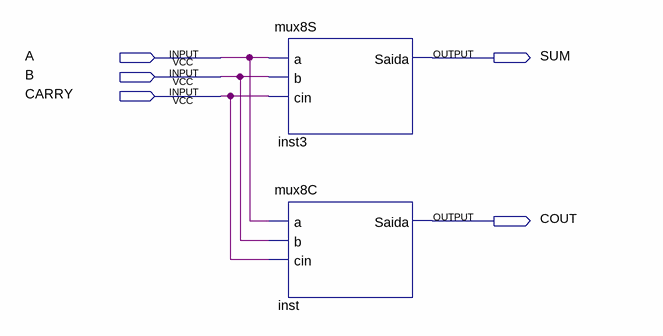
[diagram p0: schematic sheet]
// Quartus schematic Exp51.bdf as structural Verilog: 2 symbols, 5 pins
module Exp51 (
  input  A,
  input  B,
  input  CARRY,
  output SUM,
  output COUT
);

  mux8S inst3 (.a(A), .b(B), .cin(CARRY), .Saida(SUM));
  mux8C inst (.a(A), .b(B), .cin(CARRY), .Saida(COUT));
endmodule
